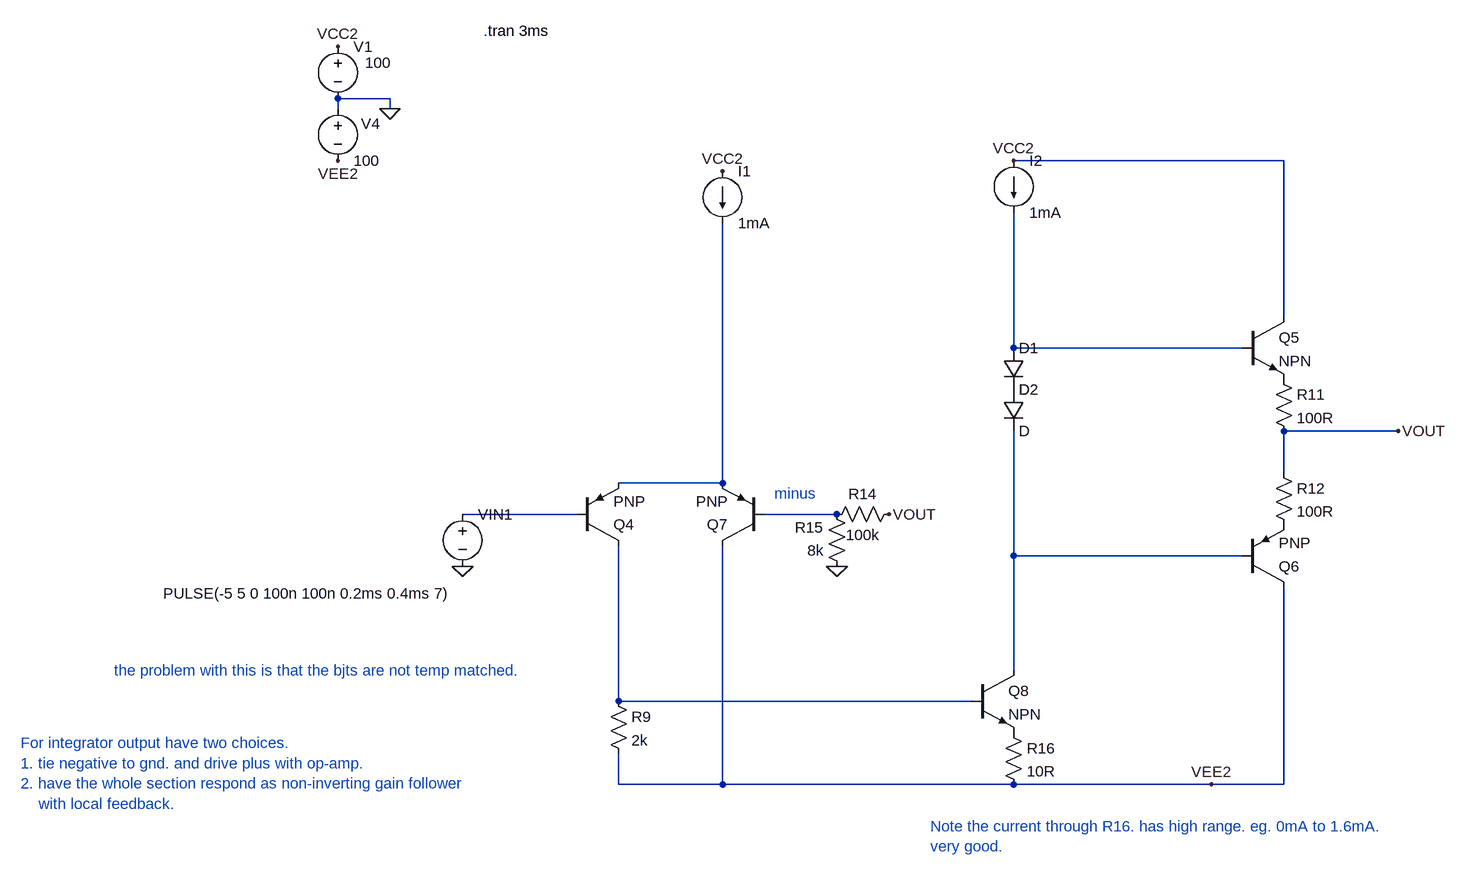
[diagram p0: schematic Draft44.asc]
Draft44.asc, the LTspice schematic file:
Version 4
SHEET 1 1508 952
WIRE -256 -288 -336 -288
WIRE -336 -272 -336 -288
WIRE -256 -272 -256 -288
WIRE 1120 -192 704 -192
WIRE 1120 48 1120 -192
WIRE 704 96 704 -112
WIRE 1056 96 704 96
WIRE 1296 224 1120 224
WIRE 1120 288 1120 224
WIRE 256 304 256 -96
WIRE 256 304 96 304
WIRE 32 352 -144 352
WIRE 432 352 320 352
WIRE 704 416 704 224
WIRE 1056 416 704 416
WIRE 704 592 704 416
WIRE 96 640 96 400
WIRE 640 640 96 640
WIRE 96 768 96 720
WIRE 256 768 256 400
WIRE 256 768 96 768
WIRE 704 768 256 768
WIRE 1008 768 704 768
WIRE 1120 768 1120 464
WIRE 1120 768 1008 768
FLAG -256 -272 0
FLAG -336 -368 VCC2
FLAG -336 -192 VEE2
FLAG 704 -192 VCC2
FLAG 1008 768 VEE2
FLAG 1296 224 VOUT
FLAG -144 432 0
FLAG 432 432 0
FLAG 256 -176 VCC2
FLAG 512 352 VOUT
SYMBOL voltage -336 -384 R0
WINDOW 123 0 0 Left 0
WINDOW 39 0 0 Left 0
WINDOW 3 42 41 Left 2
SYMATTR Value 100
SYMATTR InstName V1
SYMBOL voltage -336 -288 R0
WINDOW 123 0 0 Left 0
WINDOW 39 0 0 Left 0
WINDOW 0 36 39 Left 2
SYMATTR InstName V4
SYMATTR Value 100
SYMBOL npn 1056 48 R0
SYMATTR InstName Q5
SYMBOL res 1104 128 R0
SYMATTR InstName R11
SYMATTR Value 100R
SYMBOL res 1104 272 R0
SYMATTR InstName R12
SYMATTR Value 100R
SYMBOL pnp 1056 464 M180
SYMATTR InstName Q6
SYMBOL voltage -144 336 R0
WINDOW 123 0 0 Left 0
WINDOW 39 0 0 Left 0
WINDOW 3 -461 138 Left 2
SYMATTR Value PULSE(-5 5 0 100n 100n 0.2ms 0.4ms 7)
SYMATTR InstName VIN1
SYMBOL res 80 624 R0
SYMATTR InstName R9
SYMATTR Value 2k
SYMBOL res 528 336 R90
WINDOW 0 0 56 VBottom 2
WINDOW 3 32 56 VTop 2
SYMATTR InstName R14
SYMATTR Value 100k
SYMBOL res 448 448 R180
WINDOW 0 36 76 Left 2
WINDOW 3 36 40 Left 2
SYMATTR InstName R15
SYMATTR Value 8k
SYMBOL res 688 672 R0
SYMATTR InstName R16
SYMATTR Value 10R
SYMBOL pnp 32 400 M180
SYMATTR InstName Q4
SYMBOL pnp 320 400 R180
SYMATTR InstName Q7
SYMBOL npn 640 592 R0
SYMATTR InstName Q8
SYMBOL diode 688 96 R0
SYMATTR InstName D1
SYMBOL diode 688 160 R0
SYMATTR InstName D2
SYMBOL current 256 -176 R0
WINDOW 123 0 0 Left 0
WINDOW 39 0 0 Left 0
SYMATTR InstName I1
SYMATTR Value 1mA
SYMBOL current 704 -192 R0
WINDOW 123 0 0 Left 0
WINDOW 39 0 0 Left 0
SYMATTR InstName I2
SYMATTR Value 1mA
TEXT -112 -392 Left 2 !.tran 3ms
TEXT 336 320 Left 2 ;minus
TEXT -680 592 Left 2 ;the problem with this is that the bjts are not temp matched.
TEXT 576 832 Left 2 ;Note the current through R16. has high range. eg. 0mA to 1.6mA.\nvery good.
TEXT -824 704 Left 2 ;For integrator output have two choices.\n1. tie negative to gnd. and drive plus with op-amp.\n2. have the whole section respond as non-inverting gain follower\n    with local feedback.

The netlist it stands for:
* Draft44.asc
V1 VCC2 0 100
V4 0 VEE2 100
Q5 VCC2 N001 P001 0 NPN
R11 P001 VOUT 100R
R12 VOUT P002 100R
Q6 VEE2 N005 P002 0 PNP
VIN1 N003 0 PULSE(-5 5 0 100n 100n 0.2ms 0.4ms 7)
R9 N006 VEE2 2k
R14 VOUT N004 100k
R15 0 N004 8k
R16 P003 VEE2 10R
Q4 N006 N003 N002 0 PNP
Q7 VEE2 N004 N002 0 PNP
Q8 N005 N006 P003 0 NPN
D1 N001 P004 D
D2 P004 N005 D
I1 VCC2 N002 1mA
I2 VCC2 N001 1mA
.model D D
.lib standard.dio
.model NPN NPN
.model PNP PNP
.lib standard.bjt
.tran 3ms
* minus
* the problem with this is that the bjts are not temp matched.
* Note the current through R16. has high range. eg. 0mA to 1.6mA.
* very good.
* For integrator output have two choices.
* 1. tie negative to gnd. and drive plus with op-amp.
* 2. have the whole section respond as non-inverting gain follower
*     with local feedback.
.backanno
.end